# EAGLE design Lixieuhr-Segment (EAGLE 7.7.0)
PROJEKT_NAME: Hautplatine; REVISION: V01; SCH_SHEET_NAME: Lixieuhr; USER_NAME: Akpinar Eren
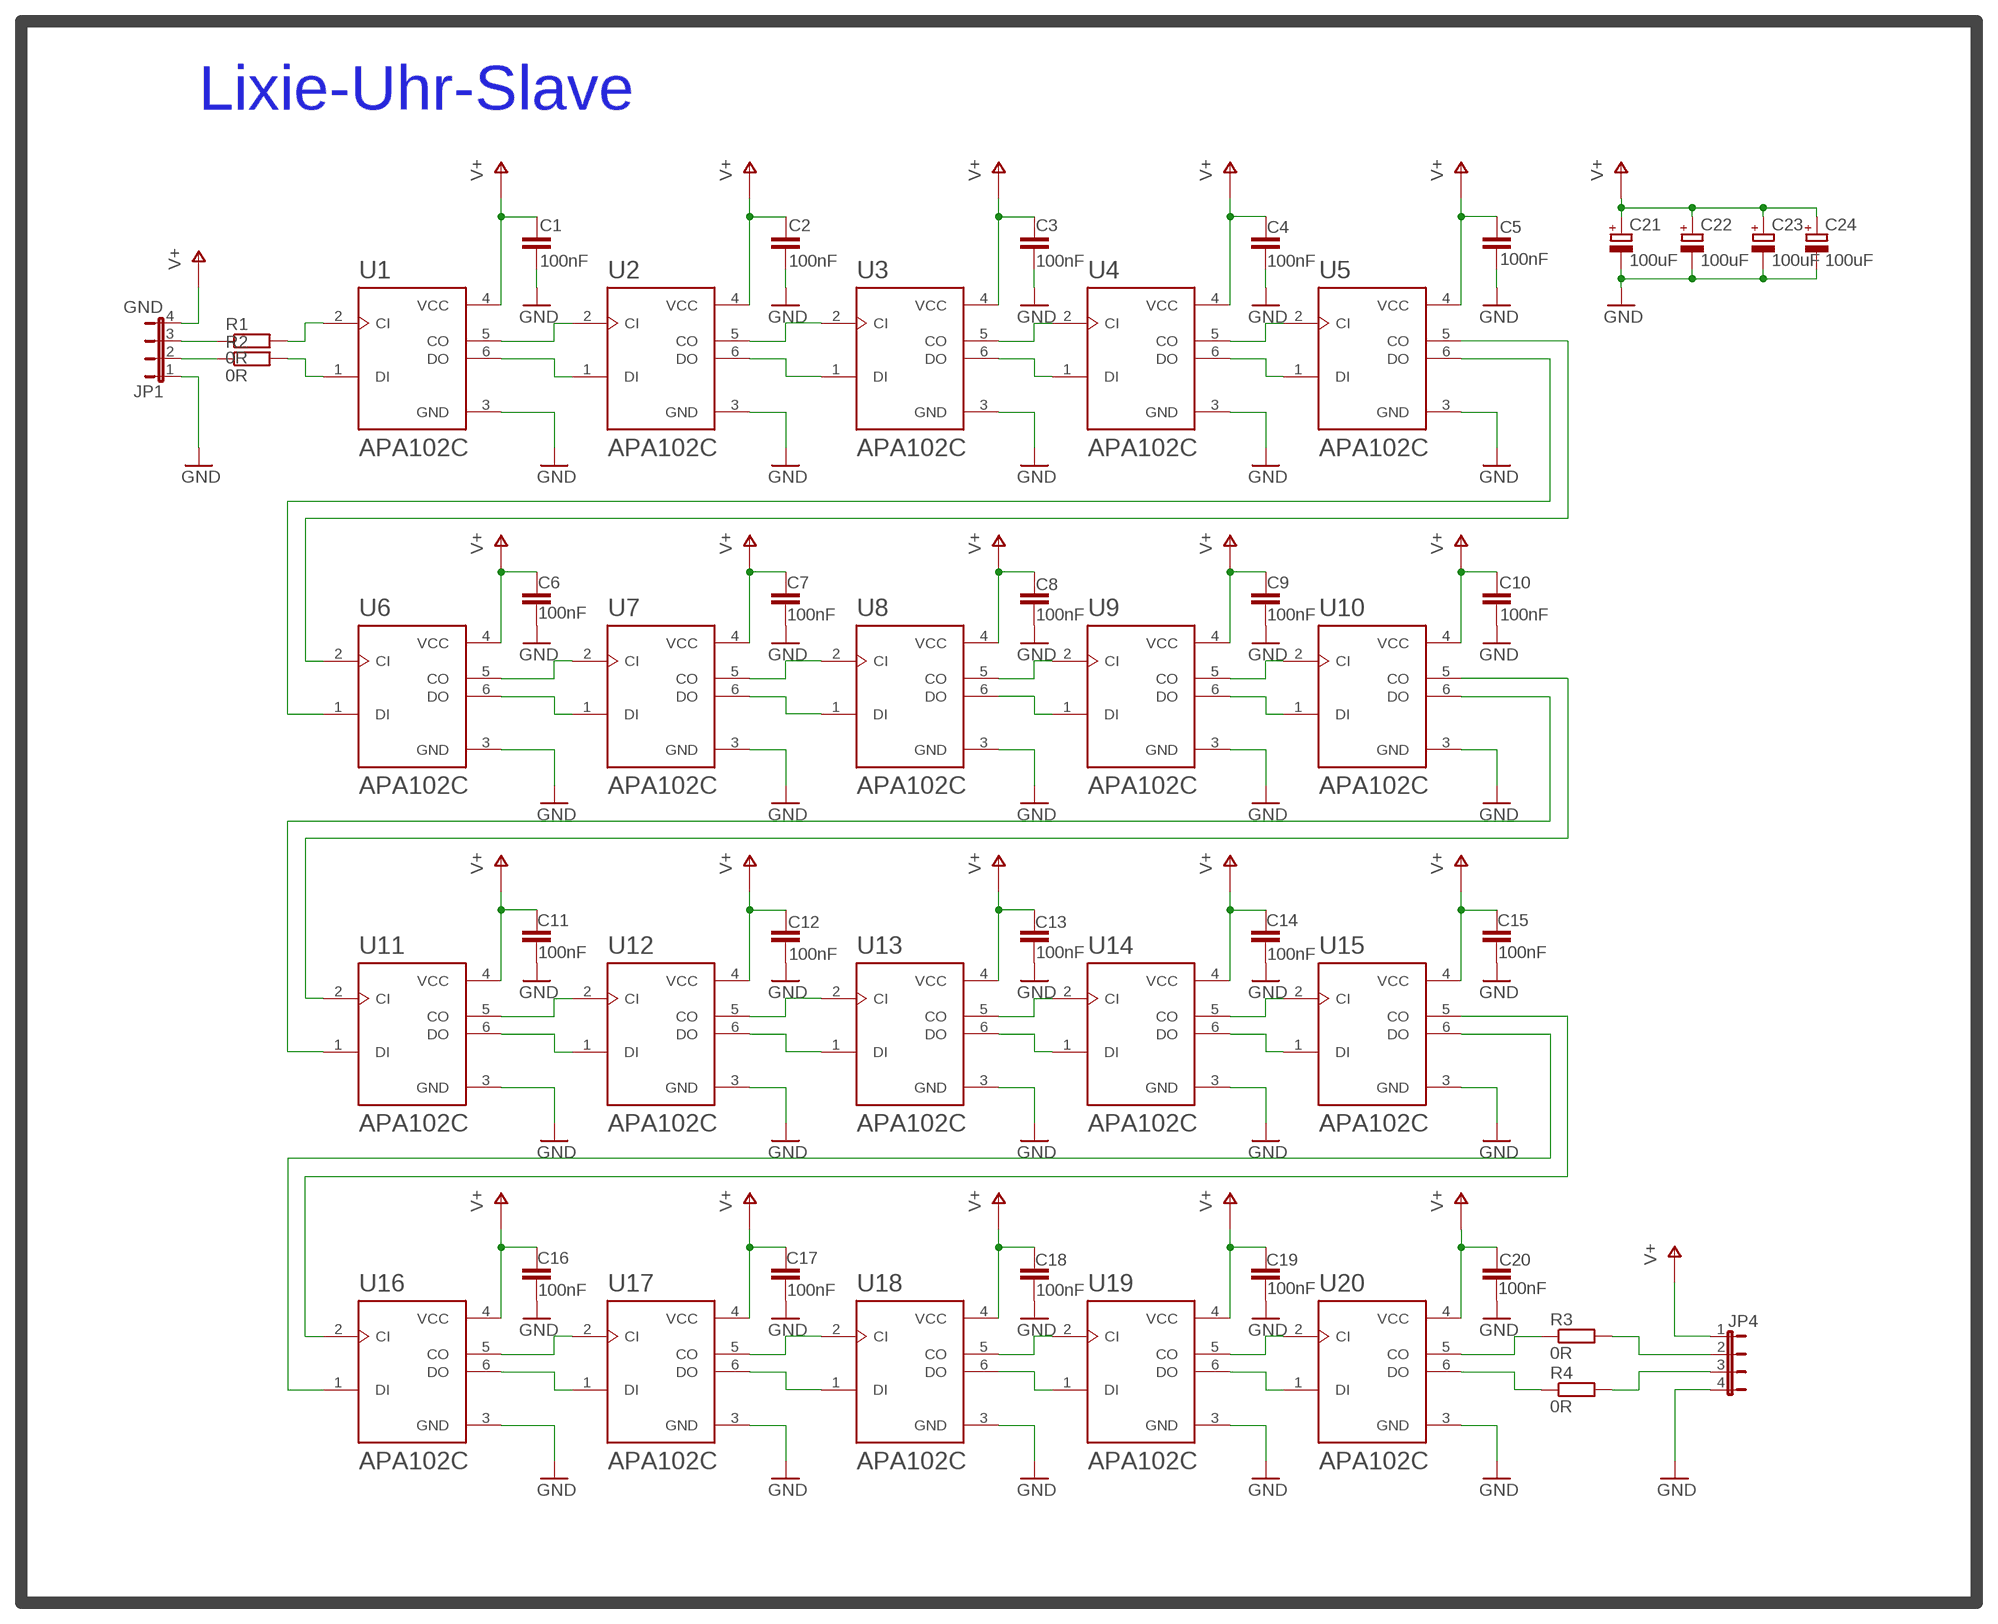
[diagram p0: schematic, sheet 1]

## Parts
C1  100nF  C-0805  [C0805]
C2  100nF  C-0805  [C0805]
C3  100nF  C-0805  [C0805]
C4  100nF  C-0805  [C0805]
C5  100nF  C-0805  [C0805]
C6  100nF  C-0805  [C0805]
C7  100nF  C-0805  [C0805]
C8  100nF  C-0805  [C0805]
C9  100nF  C-0805  [C0805]
C10  100nF  C-0805  [C0805]
C11  100nF  C-0805  [C0805]
C12  100nF  C-0805  [C0805]
C13  100nF  C-0805  [C0805]
C14  100nF  C-0805  [C0805]
C15  100nF  C-0805  [C0805]
C16  100nF  C-0805  [C0805]
C17  100nF  C-0805  [C0805]
C18  100nF  C-0805  [C0805]
C19  100nF  C-0805  [C0805]
C20  100nF  C-0805  [C0805]
C21  100uF  CPOL-EU153CLV-0405  [153CLV-0405]
C22  100uF  CPOL-EU153CLV-0405  [153CLV-0405]
C23  100uF  CPOL-EU153CLV-0405  [153CLV-0405]
C24  100uF  CPOL-EU153CLV-0405  [153CLV-0405]
JP1  GND  JP4E  [JP4]
JP4  JP4E  [JP4]
R1  0R  R-R1206  [R1206]
R2  0R  R-R1206  [R1206]
R3  0R  R-R1206  [R1206]
R4  0R  R-R1206  [R1206]
U1  APA102C  [SON160P500X500X140-6N]
U2  APA102C  [SON160P500X500X140-6N]
U3  APA102C  [SON160P500X500X140-6N]
U4  APA102C  [SON160P500X500X140-6N]
U5  APA102C  [SON160P500X500X140-6N]
U6  APA102C  [SON160P500X500X140-6N]
U7  APA102C  [SON160P500X500X140-6N]
U8  APA102C  [SON160P500X500X140-6N]
U9  APA102C  [SON160P500X500X140-6N]
U10  APA102C  [SON160P500X500X140-6N]
U11  APA102C  [SON160P500X500X140-6N]
U12  APA102C  [SON160P500X500X140-6N]
U13  APA102C  [SON160P500X500X140-6N]
U14  APA102C  [SON160P500X500X140-6N]
U15  APA102C  [SON160P500X500X140-6N]
U16  APA102C  [SON160P500X500X140-6N]
U17  APA102C  [SON160P500X500X140-6N]
U18  APA102C  [SON160P500X500X140-6N]
U19  APA102C  [SON160P500X500X140-6N]
U20  APA102C  [SON160P500X500X140-6N]

## Nets
GND: C1.1 C2.1 C3.1 C4.1 C5.1 C6.1 C7.1 C8.1 C9.1 C10.1 C11.1 C12.1 C13.1 C14.1 C15.1 C16.1 C17.1 C18.1 C19.1 C20.1 C21.- C22.- C23.- C24.- JP1.1 JP4.4 U1.3(GND) U2.3(GND) U3.3(GND) U4.3(GND) U5.3(GND) U6.3(GND) U7.3(GND) U8.3(GND) U9.3(GND) U10.3(GND) U11.3(GND) U12.3(GND) U13.3(GND) U14.3(GND) U15.3(GND) U16.3(GND) U17.3(GND) U18.3(GND) U19.3(GND) U20.3(GND)
N$1: U1.5(CO) U2.2(CI)
N$2: U2.5(CO) U3.2(CI)
N$3: U3.5(CO) U4.2(CI)
N$4: U4.5(CO) U5.2(CI)
N$5: R2.2 U1.1(DI)
N$6: U6.5(CO) U7.2(CI)
N$7: U7.5(CO) U8.2(CI)
N$8: U8.5(CO) U9.2(CI)
N$9: U9.5(CO) U10.2(CI)
N$10: U1.6(DO) U2.1(DI)
N$11: U2.6(DO) U3.1(DI)
N$12: U3.6(DO) U4.1(DI)
N$13: U4.6(DO) U5.1(DI)
N$14: JP1.2 R2.1
N$15: U9.6(DO) U10.1(DI)
N$16: U6.6(DO) U7.1(DI)
N$17: U7.6(DO) U8.1(DI)
N$18: U8.6(DO) U9.1(DI)
N$19: U5.5(CO) U6.2(CI)
N$20: R1.2 U1.2(CI)
N$21: U10.5(CO) U11.2(CI)
N$22: U10.6(DO) U11.1(DI)
N$23: U11.5(CO) U12.2(CI)
N$24: U12.5(CO) U13.2(CI)
N$25: U13.5(CO) U14.2(CI)
N$26: U14.5(CO) U15.2(CI)
N$27: U16.5(CO) U17.2(CI)
N$28: U17.5(CO) U18.2(CI)
N$29: U18.5(CO) U19.2(CI)
N$30: U19.5(CO) U20.2(CI)
N$31: U11.6(DO) U12.1(DI)
N$32: U12.6(DO) U13.1(DI)
N$33: U13.6(DO) U14.1(DI)
N$34: U14.6(DO) U15.1(DI)
N$35: JP1.3 R1.1
N$36: U19.6(DO) U20.1(DI)
N$37: U16.6(DO) U17.1(DI)
N$38: U17.6(DO) U18.1(DI)
N$39: U18.6(DO) U19.1(DI)
N$40: R3.1 U20.5(CO)
N$41: JP4.2 R3.2
N$42: JP4.3 R4.2
N$43: R4.1 U20.6(DO)
N$46: U5.6(DO) U6.1(DI)
N$47: U15.5(CO) U16.2(CI)
N$48: U15.6(DO) U16.1(DI)
V+: C1.2 C2.2 C3.2 C4.2 C5.2 C6.2 C7.2 C8.2 C9.2 C10.2 C11.2 C12.2 C13.2 C14.2 C15.2 C16.2 C17.2 C18.2 C19.2 C20.2 C21.+ C22.+ C23.+ C24.+ JP1.4 JP4.1 U1.4(VCC) U2.4(VCC) U3.4(VCC) U4.4(VCC) U5.4(VCC) U6.4(VCC) U7.4(VCC) U8.4(VCC) U9.4(VCC) U10.4(VCC) U11.4(VCC) U12.4(VCC) U13.4(VCC) U14.4(VCC) U15.4(VCC) U16.4(VCC) U17.4(VCC) U18.4(VCC) U19.4(VCC) U20.4(VCC)

## Notes on the sheet
- Lixie-Uhr-Slave

## Library data of the parts
C1-C20 = 0_HTL_MegaCard_V3:C: Capacitor
C21-C24 = resistor:CPOL-EU: POLARIZED CAPACITOR, European symbol
JP1 JP4 = jumper:JP4E: JUMPER
R1-R4 = 0_HTL_MegaCard_V3:R: Resistor
U1-U20 = APA102C:APA102C: RGB Full Color LED control IC Check availability <https://pricing.snapeda.com/parts/APA102C/Shiji%20Lighting/view-part?ref=eda>; AVAILABILITY: Not in stock; DESCRIPTION: Addressable Lighting - 1 LED Discrete Serial Red, Green, Blue (RGB) 5.00mm L x 5.00mm W; MF: Shiji Lighting; MP: APA102C; PACKAGE: SMD-6 Shiji Lightning; PRICE: None

## Board
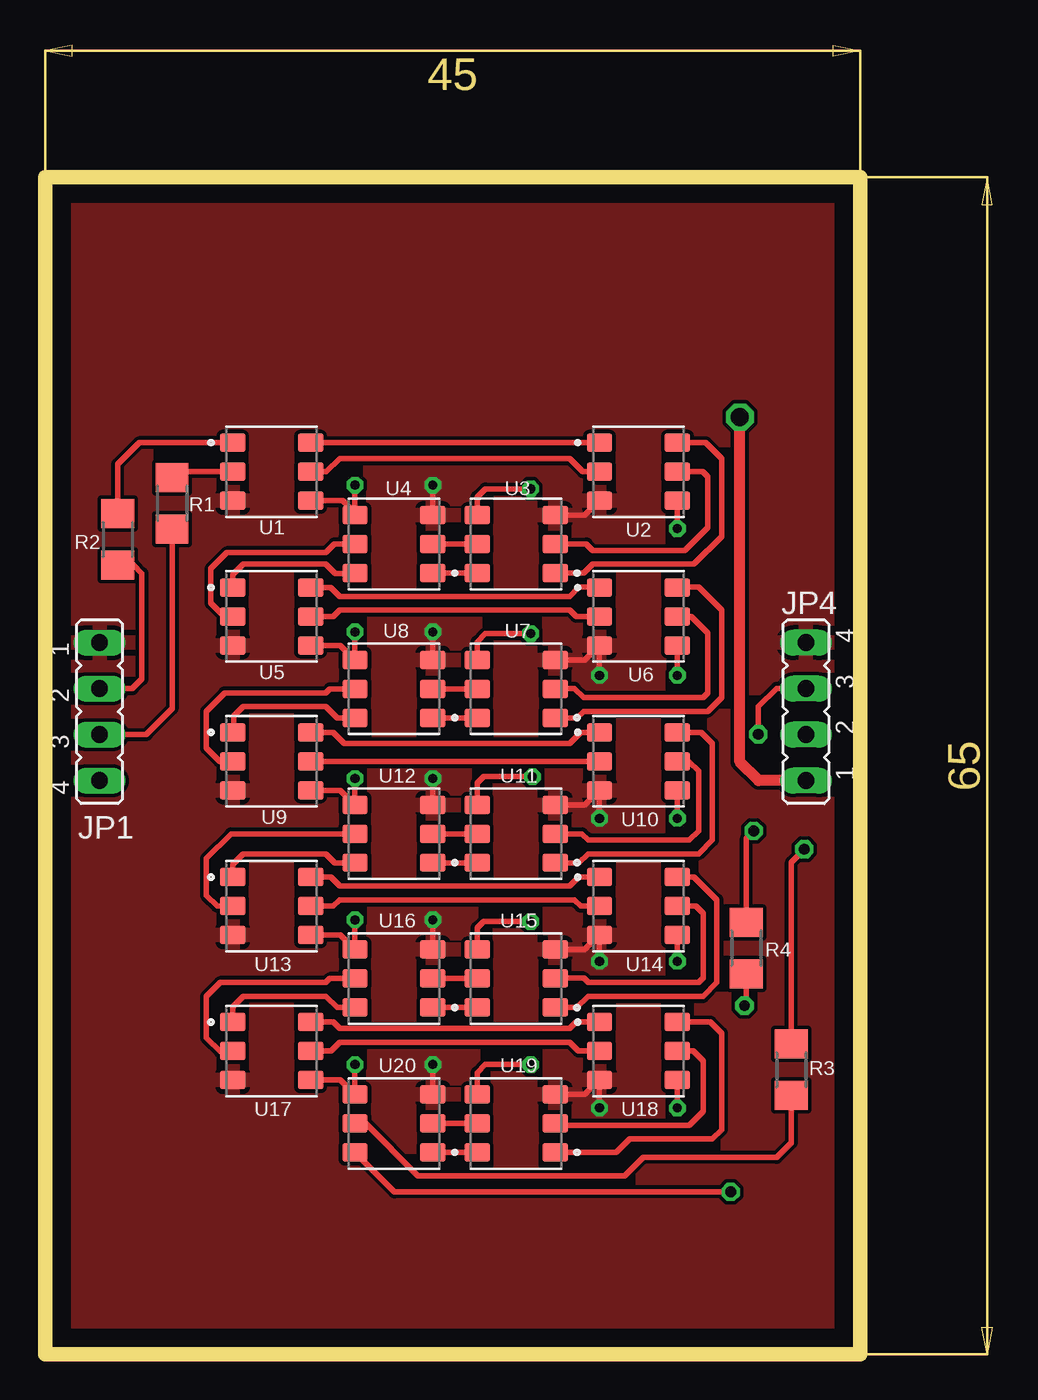
[diagram p1: board, top side]
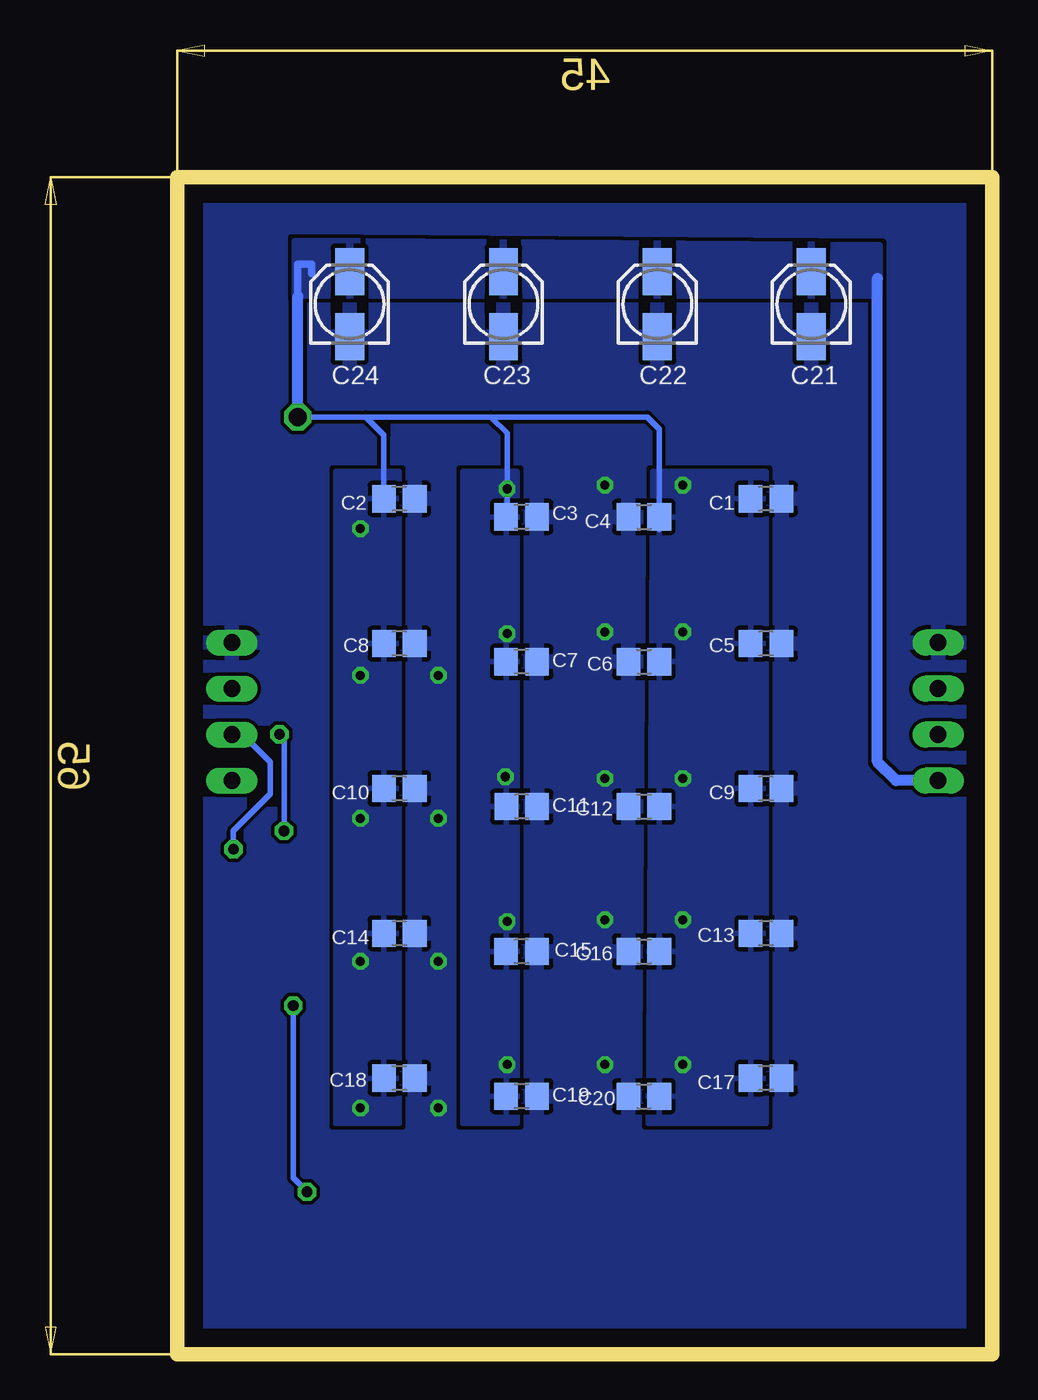
[diagram p2: board, bottom side, seen from below]

Size 45 x 65 mm. Coordinates in mm from the lower left corner, seen from the top.
Outline: 0,0 45,0 45,65 0,65 0,0
Copper layers (1*16): Top 0.035mm / dielectric 1.5mm / Bottom 0.035mm
Design rules "default *": minimum track width 10mil, minimum drill 15mil, track to track 8mil, track to pad 8mil, pad to pad 8mil, via to via 8mil, smd to smd 8mil, copper to edge 40mil, drill to drill 8mil, minimum pad ring 10mil, minimum via ring 8mil, stop-mask expansion 4mil, vias tented up to drill 0mil, thermal gap 10mil

### Footprints (pad centres in the part's own frame; a part is rotated, then mirrored left to right if it is on the bottom)
C0805 = smd 1.3 x 1.5: 1 -0.85,0; 2 0.85,0
153CLV-0405 = smd 2.6 x 1.6: + 1.8,0; - -1.8,0
JP4 = drill 0.914 long: 1 -3.81,0; 2 -1.27,0; 3 1.27,0; 4 3.81,0
R1206 = smd 1.6 x 1.803: 1 -1.422,0; 2 1.422,0
SON160P500X500X140-6N = smd 1.41 x 1.03: 1 -2.15,1.6; 2 -2.15,0; 3 -2.15,-1.6; 4 2.15,-1.6; 5 2.15,0; 6 2.15,1.6

### Placement (x,y rotation side)
C1  12.5,47.25 180 bottom
C2  32.75,47.25 180 bottom
C3  26,46.25 180 bottom
C4  19.25,46.25 0 bottom
C5  12.5,39.25 180 bottom
C6  19.25,38.25 0 bottom
C7  26,38.25 180 bottom
C8  32.75,39.25 180 bottom
C9  12.5,31.25 180 bottom
C10  32.75,31.25 180 bottom
C11  26,30.25 180 bottom
C12  19.25,30.25 0 bottom
C13  12.5,23.25 180 bottom
C14  32.75,23.25 180 bottom
C15  26,22.25 180 bottom
C16  19.25,22.25 0 bottom
C17  12.5,15.25 180 bottom
C18  32.75,15.25 180 bottom
C19  26,14.25 180 bottom
C20  19.25,14.25 0 bottom
C21  10,58 90 bottom
C22  18.5,58 90 bottom
C23  27,58 90 bottom
C24  35.5,58 90 bottom
JP1  3,35.5 270 top
JP4  42,35.5 90 top
R1  7,47 90 top
R2  4,45 90 top
R3  41.19,15.71 90 top
R4  38.7,22.43 90 top
U1  12.5,48.75 0 top
U2  32.75,48.75 0 top
U3  26,44.75 180 top
U4  19.25,44.75 180 top
U5  12.5,40.75 0 top
U6  32.75,40.75 0 top
U7  26,36.75 180 top
U8  19.25,36.75 180 top
U9  12.5,32.75 0 top
U10  32.75,32.75 0 top
U11  26,28.75 180 top
U12  19.25,28.75 180 top
U13  12.5,24.75 0 top
U14  32.75,24.75 0 top
U15  26,20.75 180 top
U16  19.25,20.75 180 top
U17  12.5,16.75 0 top
U18  32.75,16.75 0 top
U19  26,12.75 180 top
U20  19.25,12.75 180 top

### Tracks (layer width: path | path; a pad name or v marks a point on that pad's centre or on a via)
GND  (via drill 0.5)
  Top 0.305: U16.3 v21.4,24 | U12.3 v21.4,31.8 | U8.3 v21.4,39.9 | U20.3 v21.4,16 | U11.3 29.8,30.35 U10.3 v30.6,29.6 | U7.3 29.8,38.35 U6.3 v30.6,37.5 | U3.3 29.8,46.35 U2.3 | U19.3 29.8,14.35 U18.3 v30.6,13.6 | U15.3 29.8,22.35 U14.3 v30.6,21.7 | U4.3 v21.4,48
  pour Top: 1,64 1,1 44,1 44,64
  pour Bottom: 19.75,48.75 20,12.75 25.25,12.75 25.5,48.75
  pour Bottom (rank 2): 44,64 44,1 1,1 1,64
N$1
  Top 0.305: U1.5 15.52,48.75 16.26,49.48 28.96,49.48 29.69,48.75 U2.2
N$2
  Top 0.305: U2.5 36.29,48.75 36.58,48.47 36.58,45.67 35.31,44.4 30.23,44.4 29.88,44.75 U3.2
N$3
  Top 0.305: U4.2 U3.5
N$4
  Top 0.305: U4.5 15.97,44.75 15.49,44.27 10.03,44.27 9.14,43.39 9.14,41.48 9.88,40.75 U5.2
N$5
  Top 0.305: U1.1 5.19,50.35 4,49.16 R2.2
N$6
  Top 0.305: U6.5 35.66,40.75 36.58,39.83 36.58,36.53 36.32,36.27 29.72,36.27 29.21,36.78 28.18,36.78 U7.2
N$7
  Top 0.305: U8.2 U7.5
N$8
  Top 0.305: U9.2 9.62,32.75 8.89,33.48 8.89,35.51 9.91,36.53 15.49,36.53 15.72,36.75 U8.5
N$9
  Top 0.305: U9.5 U10.2
N$10
  Top 0.305: U1.6 U2.1
N$11
  Top 0.305: U3.1 29.74,43.15 30.23,43.64 35.81,43.64 37.34,45.16 37.34,49.48 36.47,50.35 U2.6
N$12
  Top 0.305: U4.1 U3.6
N$13
  Top 0.305: U5.1 10.35,43.07 10.92,43.64 15.49,43.64 16,43.13 17.08,43.13 U4.6
N$14
  Top 0.305: JP1.2 4.81,36.77 5.33,37.29 5.33,43.13 4.89,43.58 R2.1
N$15
  Top 0.305: U9.6 15.89,34.35 16.51,33.73 28.96,33.73 29.57,34.35 U10.1
N$16
  Top 0.305: U7.1 29.36,35.15 29.72,35.51 36.58,35.51 37.34,36.27 37.34,41.1 36.07,42.37 34.92,42.37 U6.6
N$17
  Top 0.305: U8.1 U7.6
N$18
  Top 0.305: U8.6 16.11,35.15 15.49,35.77 10.92,35.77 10.41,35.26 10.41,34.41 U9.1
N$19
  Top 0.305: U5.5 15.91,40.75 16.26,41.1 28.96,41.1 29.31,40.75 U6.2
N$20
  Top 0.305: U1.2 7.33,48.75 R1.2
N$21
  Top 0.305: U10.5 34.93,32.72 35.56,32.72 36.07,32.21 36.07,28.91 35.56,28.4 29.97,28.4 29.62,28.75 U11.2
N$22
  Top 0.305: U10.6 36.21,34.35 36.83,33.73 36.83,28.4 36.07,27.64 29.97,27.64 29.46,27.13 28.17,27.13 U11.1
N$23
  Top 0.305: U12.2 U11.5
N$24
  Top 0.305: U13.2 9.49,24.75 8.89,25.35 8.89,27.38 10.26,28.75 U12.5
N$25
  Top 0.305: U13.5 15.91,24.75 16.26,25.1 29.21,25.1 29.56,24.75 U14.2
N$26
  Top 0.305: U15.2 28.18,20.78 29.72,20.78 29.97,20.53 36.07,20.53 36.32,20.78 36.32,24.34 35.91,24.75 U14.5
N$27
  Top 0.305: U17.2 10.32,16.72 9.65,16.72 8.89,17.48 8.89,19.76 9.65,20.53 15.49,20.53 15.72,20.75 U16.5
N$28
  Top 0.305: U17.5 15.78,16.75 16.26,17.22 28.96,17.22 29.43,16.75 U18.2
N$29
  Top 0.305: U18.5 35.78,16.75 36.32,16.21 36.32,13.41 35.56,12.65 28.25,12.65 U19.2
N$30
  Top 0.305: U20.2 U19.5
N$31
  Top 0.305: U12.1 U11.6
N$32
  Top 0.305: U12.6 15.98,27.15 15.49,27.64 10.92,27.64 10.35,27.07 U13.1
N$33
  Top 0.305: U13.6 15.77,26.35 16.26,25.86 28.96,25.86 29.46,26.37 30.58,26.37 U14.1
N$34
  Top 0.305: U15.1 29.36,19.15 29.97,19.76 36.32,19.76 37.08,20.53 37.08,25.1 35.81,26.37 34.92,26.37 U14.6
N$35
  Top 0.305: JP1.3 5.58,34.23 7,35.65 R1.1
N$36
  Top 0.305: U20.1 U19.6
N$37
  Top 0.305: U16.6 16.11,19.15 15.49,19.76 10.92,19.76 10.35,19.19 U17.1
N$38
  Top 0.305: U17.6 15.89,18.35 16.26,17.99 28.96,17.99 29.32,18.35 U18.1
N$39
  Top 0.305: U19.1 31.52,11.15 32.26,11.89 36.83,11.89 37.34,12.4 37.34,17.73 36.72,18.35 U18.6
N$40
  Top 0.305: U20.5 17.68,12.75 20.57,9.86 32,9.86 33.02,10.87 40.37,10.87 41.19,11.69 R3.1
N$41  (via drill 0.6)
  Top 0.305: R3.2 41.19,27.17 v41.91,27.89
  Bottom 0.305: v41.91,27.89 41.91,28.91 39.88,30.94 39.88,32.72 41.39,34.23 JP4.2
N$42  (via drill 0.6)
  Top 0.305: v39.37,34.24 39.37,35.77 40.39,36.78 41.99,36.78 JP4.3 | R4.2 38.7,28.5 v39.12,28.91
  Bottom 0.305: v39.12,28.91 39.12,33.99 v39.37,34.24
N$43  (via drill 0.6)
  Top 0.305: U20.6 19.28,8.97 v37.85,8.97 | 38.86,20.85 R4.1 38.7,19.35 v38.61,19.26
  Bottom 0.305: v38.61,19.26 38.61,9.73 v37.85,8.97
N$46
  Top 0.305: U5.6 15.77,42.35 16.26,41.86 28.96,41.86 29.46,42.37 30.58,42.37 U6.1
N$47
  Top 0.305: U16.2 U15.5
N$48
  Top 0.305: U16.1 U15.6
V+  (via drill 0.5, 1)
  Top 0.305: U5.4 16.3,39.15 U8.4 v17.1,39.9 | U13.4 16.3,23.15 U16.4 v17.1,24 | U17.4 16.3,15.15 U20.4 v17.1,16 | U1.4 16.43,47.15 17.1,46.48 U4.4 v17.1,48 | U3.4 23.85,47.35 24.3,47.8 v26.8,47.8 | U7.4 23.85,39.35 24.3,39.8 v26.8,39.8 | U11.4 23.85,31.55 24.2,31.9 v26.9,31.9 | U15.4 23.85,23.55 24.2,23.9 v26.8,23.9 | U19.4 23.85,15.55 24.3,16 v26.8,16 | v17.1,31.8 U12.4 16.3,31.15 U9.4 | U14.4 v34.9,21.7 | U10.4 v34.9,29.6 | U6.4 v34.9,37.5 | U18.4 v34.9,13.6 | U2.4 v34.9,45.6
  Top 0.61: JP4.1 39.38,31.69 38.35,32.72 v38.35,51.77
  Bottom 0.305: 18.4,45.67 C4.2 18.4,51.1 19.07,51.77 27.7,51.77 | 18.4,45.67 18.4,45.56 | 18.41,45.66 18.4,45.67 | v26.9,31.9 27,31.9 | v26.8,23.9 26.8,23.8 | C3.2 26.8,46.3 v26.8,47.8 26.8,50.87 27.7,51.77 | v38.35,51.77 34.6,51.77 | C2.2 33.6,50.77 34.6,51.77 | 34.6,51.77 27.7,51.77
  Bottom 0.406: 38.35,58.42 38.35,60.2 37.59,60.2 37.59,59.69
  Bottom 0.61: JP1.4 5.32,31.69 6.35,32.72 6.35,59.44 | v38.35,51.77 38.35,58.42
  pour Bottom: 12.5,12.75 12.5,48.75 18.75,48.75 19,12.75
  pour Bottom: 26.25,12.75 26.25,48.75 29.25,48.75 29.25,12.75
  pour Bottom: 32.75,48.75 36.25,48.75 36.25,12.75 32.75,12.75
  pour Bottom: 6.25,58.5 38.5,58.5 38.5,61.49 6.25,61.24

### Text on the board
tDrill: Material: FR4 1,5mm 35u Cu | Toleranz: Aussenmass -0,5mm, sonst +/_0,2mm | Bohrplan | SYM | SIZE | CNT | 0.60 mm | 41 | 0.80 mm | 2 | 0.90 mm | 8 | TOTAL | 51
bDrill: Material: FR4 1,5mm 35u Cu | Toleranz: Aussenmass -0,5mm, sonst +/_0,2mm | Bohrplan | CNT | SIZE | SYM | 41 | 0.60 mm | 2 | 0.80 mm | 8 | 0.91 mm | 51 | TOTAL